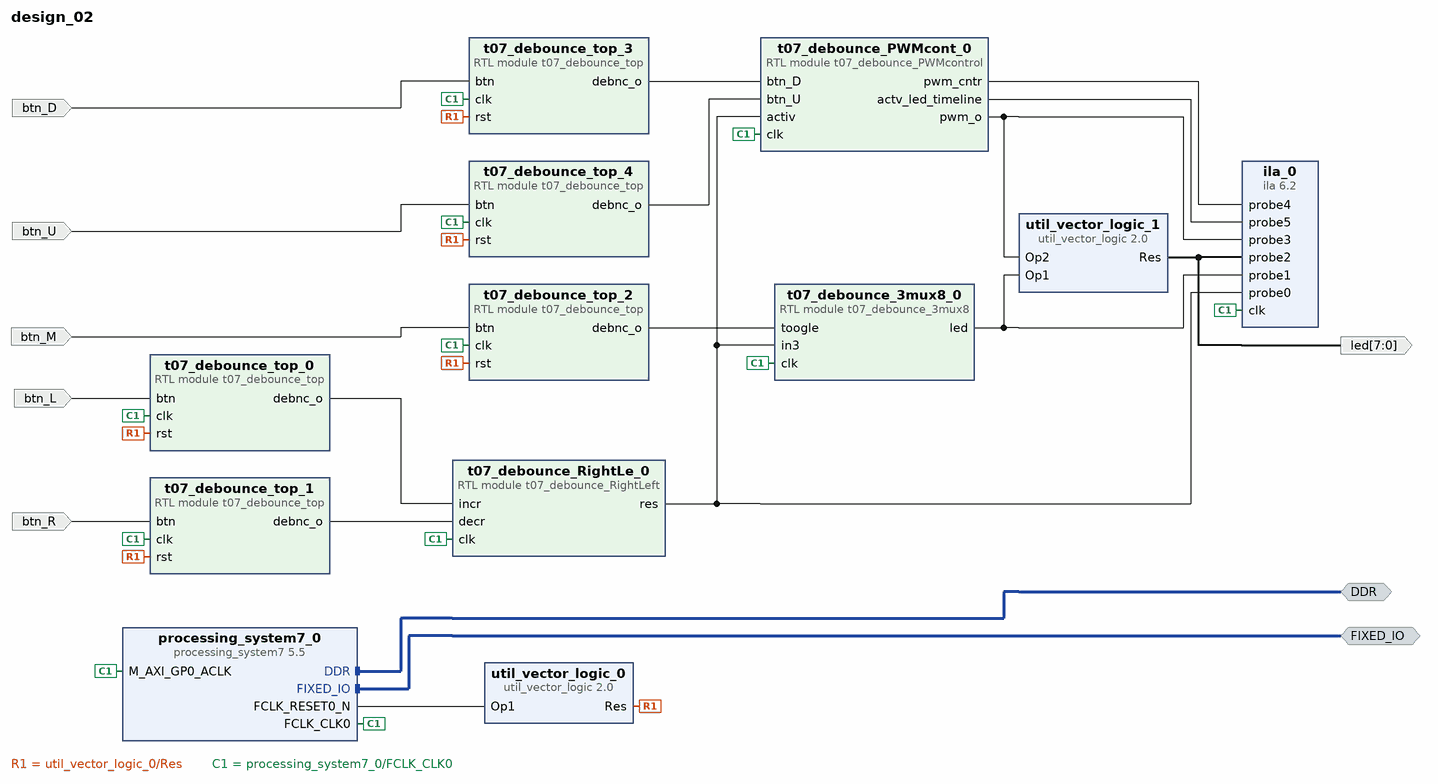
[diagram p0: block diagram of the top level]
# Vivado block design design_02, xc7z020clg484-1, Vivado 2020.1
create_bd_design design_02

create_bd_intf_port -mode Master -vlnv xilinx.com:interface:ddrx_rtl:1.0 DDR
create_bd_intf_port -mode Master -vlnv xilinx.com:display_processing_system7:fixedio_rtl:1.0 FIXED_IO
create_bd_port -dir I btn_L
create_bd_port -dir I btn_M
create_bd_port -dir I btn_R
create_bd_port -dir O -from 7 -to 0 led
create_bd_port -dir I btn_U
create_bd_port -dir I btn_D

create_bd_cell -type ip -vlnv xilinx.com:ip:processing_system7:5.5 processing_system7_0
set_property -dict [list \
  CONFIG.PCW_APU_PERIPHERAL_FREQMHZ 666.666667 \
  CONFIG.PCW_ENET0_ENET0_IO {MIO 16 .. 27} \
  CONFIG.PCW_ENET0_GRP_MDIO_ENABLE 1 \
  CONFIG.PCW_ENET0_GRP_MDIO_IO {MIO 52 .. 53} \
  CONFIG.PCW_ENET0_PERIPHERAL_ENABLE 1 \
  CONFIG.PCW_ENET0_RESET_ENABLE 0 \
  CONFIG.PCW_ENET_RESET_ENABLE 1 \
  CONFIG.PCW_ENET_RESET_SELECT {Share reset pin} \
  CONFIG.PCW_FPGA0_PERIPHERAL_FREQMHZ 100.000000 \
  CONFIG.PCW_FPGA1_PERIPHERAL_FREQMHZ 150.000000 \
  CONFIG.PCW_FPGA2_PERIPHERAL_FREQMHZ 50.000000 \
  CONFIG.PCW_GPIO_MIO_GPIO_ENABLE 1 \
  CONFIG.PCW_GPIO_MIO_GPIO_IO MIO \
  CONFIG.PCW_I2C_RESET_ENABLE 1 \
  CONFIG.PCW_PRESET_BANK1_VOLTAGE {LVCMOS 1.8V} \
  CONFIG.PCW_QSPI_GRP_SINGLE_SS_ENABLE 1 \
  CONFIG.PCW_QSPI_GRP_SINGLE_SS_IO {MIO 1 .. 6} \
  CONFIG.PCW_QSPI_PERIPHERAL_ENABLE 1 \
  CONFIG.PCW_QSPI_PERIPHERAL_FREQMHZ 200.000000 \
  CONFIG.PCW_QSPI_QSPI_IO {MIO 1 .. 6} \
  CONFIG.PCW_SD0_GRP_CD_ENABLE 1 \
  CONFIG.PCW_SD0_GRP_CD_IO {MIO 47} \
  CONFIG.PCW_SD0_GRP_WP_ENABLE 1 \
  CONFIG.PCW_SD0_GRP_WP_IO {MIO 46} \
  CONFIG.PCW_SD0_PERIPHERAL_ENABLE 1 \
  CONFIG.PCW_SD0_SD0_IO {MIO 40 .. 45} \
  CONFIG.PCW_SDIO_PERIPHERAL_FREQMHZ 50 \
  CONFIG.PCW_SINGLE_QSPI_DATA_MODE x4 \
  CONFIG.PCW_TTC0_PERIPHERAL_ENABLE 1 \
  CONFIG.PCW_TTC0_TTC0_IO EMIO \
  CONFIG.PCW_UART1_PERIPHERAL_ENABLE 1 \
  CONFIG.PCW_UART1_UART1_IO {MIO 48 .. 49} \
  CONFIG.PCW_UART_PERIPHERAL_FREQMHZ 50 \
  CONFIG.PCW_UIPARAM_DDR_FREQ_MHZ 533.333313 \
  CONFIG.PCW_UIPARAM_DDR_PARTNO {MT41J128M16 HA-15E} \
  CONFIG.PCW_USB0_PERIPHERAL_ENABLE 1 \
  CONFIG.PCW_USB0_RESET_ENABLE 0 \
  CONFIG.PCW_USB0_USB0_IO {MIO 28 .. 39} \
  CONFIG.PCW_USB_RESET_ENABLE 1 \
  CONFIG.PCW_USB_RESET_SELECT {Share reset pin} \
  CONFIG.preset ZedBoard \
] [get_bd_cells processing_system7_0]
# 221 more settings of processing_system7_0 are not shown: defaults, MIO pin electricals, DDR timing, and values the tool derives
create_bd_cell -type ip -vlnv xilinx.com:ip:util_vector_logic:2.0 util_vector_logic_0
set_property -dict {CONFIG.C_OPERATION not CONFIG.C_SIZE 0} [get_bd_cells util_vector_logic_0]
create_bd_cell -type ip -vlnv xilinx.com:ip:ila:6.2 ila_0
set_property -dict [list \
  CONFIG.C_ENABLE_ILA_AXI_MON false \
  CONFIG.C_MONITOR_TYPE Native \
  CONFIG.C_NUM_OF_PROBES 6 \
  CONFIG.C_PROBE0_WIDTH 3 \
  CONFIG.C_PROBE1_WIDTH 8 \
  CONFIG.C_PROBE2_WIDTH 8 \
  CONFIG.C_PROBE3_WIDTH 8 \
  CONFIG.C_PROBE4_WIDTH 3 \
  CONFIG.C_PROBE5_WIDTH 3 \
] [get_bd_cells ila_0]
create_bd_cell -type module -reference t07_debounce_RightLeft t07_debounce_RightLe_0
create_bd_cell -type ip -vlnv xilinx.com:ip:util_vector_logic:2.0 util_vector_logic_1
set_property -dict {CONFIG.C_OPERATION xor CONFIG.C_SIZE 8} [get_bd_cells util_vector_logic_1]
create_bd_cell -type module -reference t07_debounce_3mux8 t07_debounce_3mux8_0
create_bd_cell -type module -reference t07_debounce_top t07_debounce_top_0
create_bd_cell -type module -reference t07_debounce_top t07_debounce_top_1
create_bd_cell -type module -reference t07_debounce_top t07_debounce_top_2
create_bd_cell -type module -reference t07_debounce_top t07_debounce_top_3
create_bd_cell -type module -reference t07_debounce_top t07_debounce_top_4
create_bd_cell -type module -reference t07_debounce_PWMcontrol t07_debounce_PWMcont_0

# ---- connections ----

connect_bd_intf_net [get_bd_intf_ports DDR] [get_bd_intf_pins processing_system7_0/DDR]
connect_bd_intf_net [get_bd_intf_ports FIXED_IO] [get_bd_intf_pins processing_system7_0/FIXED_IO]
connect_bd_net [get_bd_pins util_vector_logic_0/Res] \
  [get_bd_pins t07_debounce_top_0/rst] [get_bd_pins t07_debounce_top_1/rst] [get_bd_pins t07_debounce_top_2/rst] \
  [get_bd_pins t07_debounce_top_3/rst] [get_bd_pins t07_debounce_top_4/rst]
connect_bd_net -net btn_0_1 [get_bd_ports btn_M] [get_bd_pins t07_debounce_top_2/btn]
connect_bd_net -net t07_debounce_top_0_led [get_bd_pins t07_debounce_top_1/debnc_o] [get_bd_pins t07_debounce_RightLe_0/decr]
connect_bd_net -net t07_debounce_top_1_led [get_bd_pins t07_debounce_top_0/debnc_o] [get_bd_pins t07_debounce_RightLe_0/incr]
connect_bd_net [get_bd_pins t07_debounce_RightLe_0/res] \
  [get_bd_pins ila_0/probe0] [get_bd_pins t07_debounce_3mux8_0/in3] [get_bd_pins t07_debounce_PWMcont_0/activ]
connect_bd_net [get_bd_pins processing_system7_0/FCLK_CLK0] \
  [get_bd_pins processing_system7_0/M_AXI_GP0_ACLK] [get_bd_pins ila_0/clk] [get_bd_pins t07_debounce_RightLe_0/clk] \
  [get_bd_pins t07_debounce_3mux8_0/clk] [get_bd_pins t07_debounce_top_0/clk] [get_bd_pins t07_debounce_top_1/clk] \
  [get_bd_pins t07_debounce_top_2/clk] [get_bd_pins t07_debounce_top_3/clk] [get_bd_pins t07_debounce_top_4/clk] \
  [get_bd_pins t07_debounce_PWMcont_0/clk]
connect_bd_net -net t07_debounce_top_2_led [get_bd_pins t07_debounce_top_2/debnc_o] [get_bd_pins t07_debounce_3mux8_0/toogle]
connect_bd_net [get_bd_pins t07_debounce_3mux8_0/led] [get_bd_pins ila_0/probe1] [get_bd_pins util_vector_logic_1/Op1]
connect_bd_net -net t07_debounce_top_4_led [get_bd_pins t07_debounce_top_4/debnc_o] [get_bd_pins t07_debounce_PWMcont_0/btn_U]
connect_bd_net [get_bd_ports btn_D] [get_bd_pins t07_debounce_top_3/btn]
connect_bd_net -net t07_debounce_top_3_led [get_bd_pins t07_debounce_top_3/debnc_o] [get_bd_pins t07_debounce_PWMcont_0/btn_D]
connect_bd_net [get_bd_ports btn_L] [get_bd_pins t07_debounce_top_0/btn]
connect_bd_net [get_bd_ports btn_R] [get_bd_pins t07_debounce_top_1/btn]
connect_bd_net [get_bd_pins t07_debounce_PWMcont_0/pwm_cntr] [get_bd_pins ila_0/probe4]
connect_bd_net [get_bd_ports btn_U] [get_bd_pins t07_debounce_top_4/btn]
connect_bd_net [get_bd_pins t07_debounce_PWMcont_0/pwm_o] [get_bd_pins ila_0/probe3] [get_bd_pins util_vector_logic_1/Op2]
connect_bd_net [get_bd_pins processing_system7_0/FCLK_RESET0_N] [get_bd_pins util_vector_logic_0/Op1]
connect_bd_net [get_bd_pins util_vector_logic_1/Res] [get_bd_pins ila_0/probe2] [get_bd_ports led]
connect_bd_net [get_bd_pins t07_debounce_PWMcont_0/actv_led_timeline] [get_bd_pins ila_0/probe5]

validate_bd_design
save_bd_design
